# EAGLE schematic DotControl (EAGLE 7.7.0)
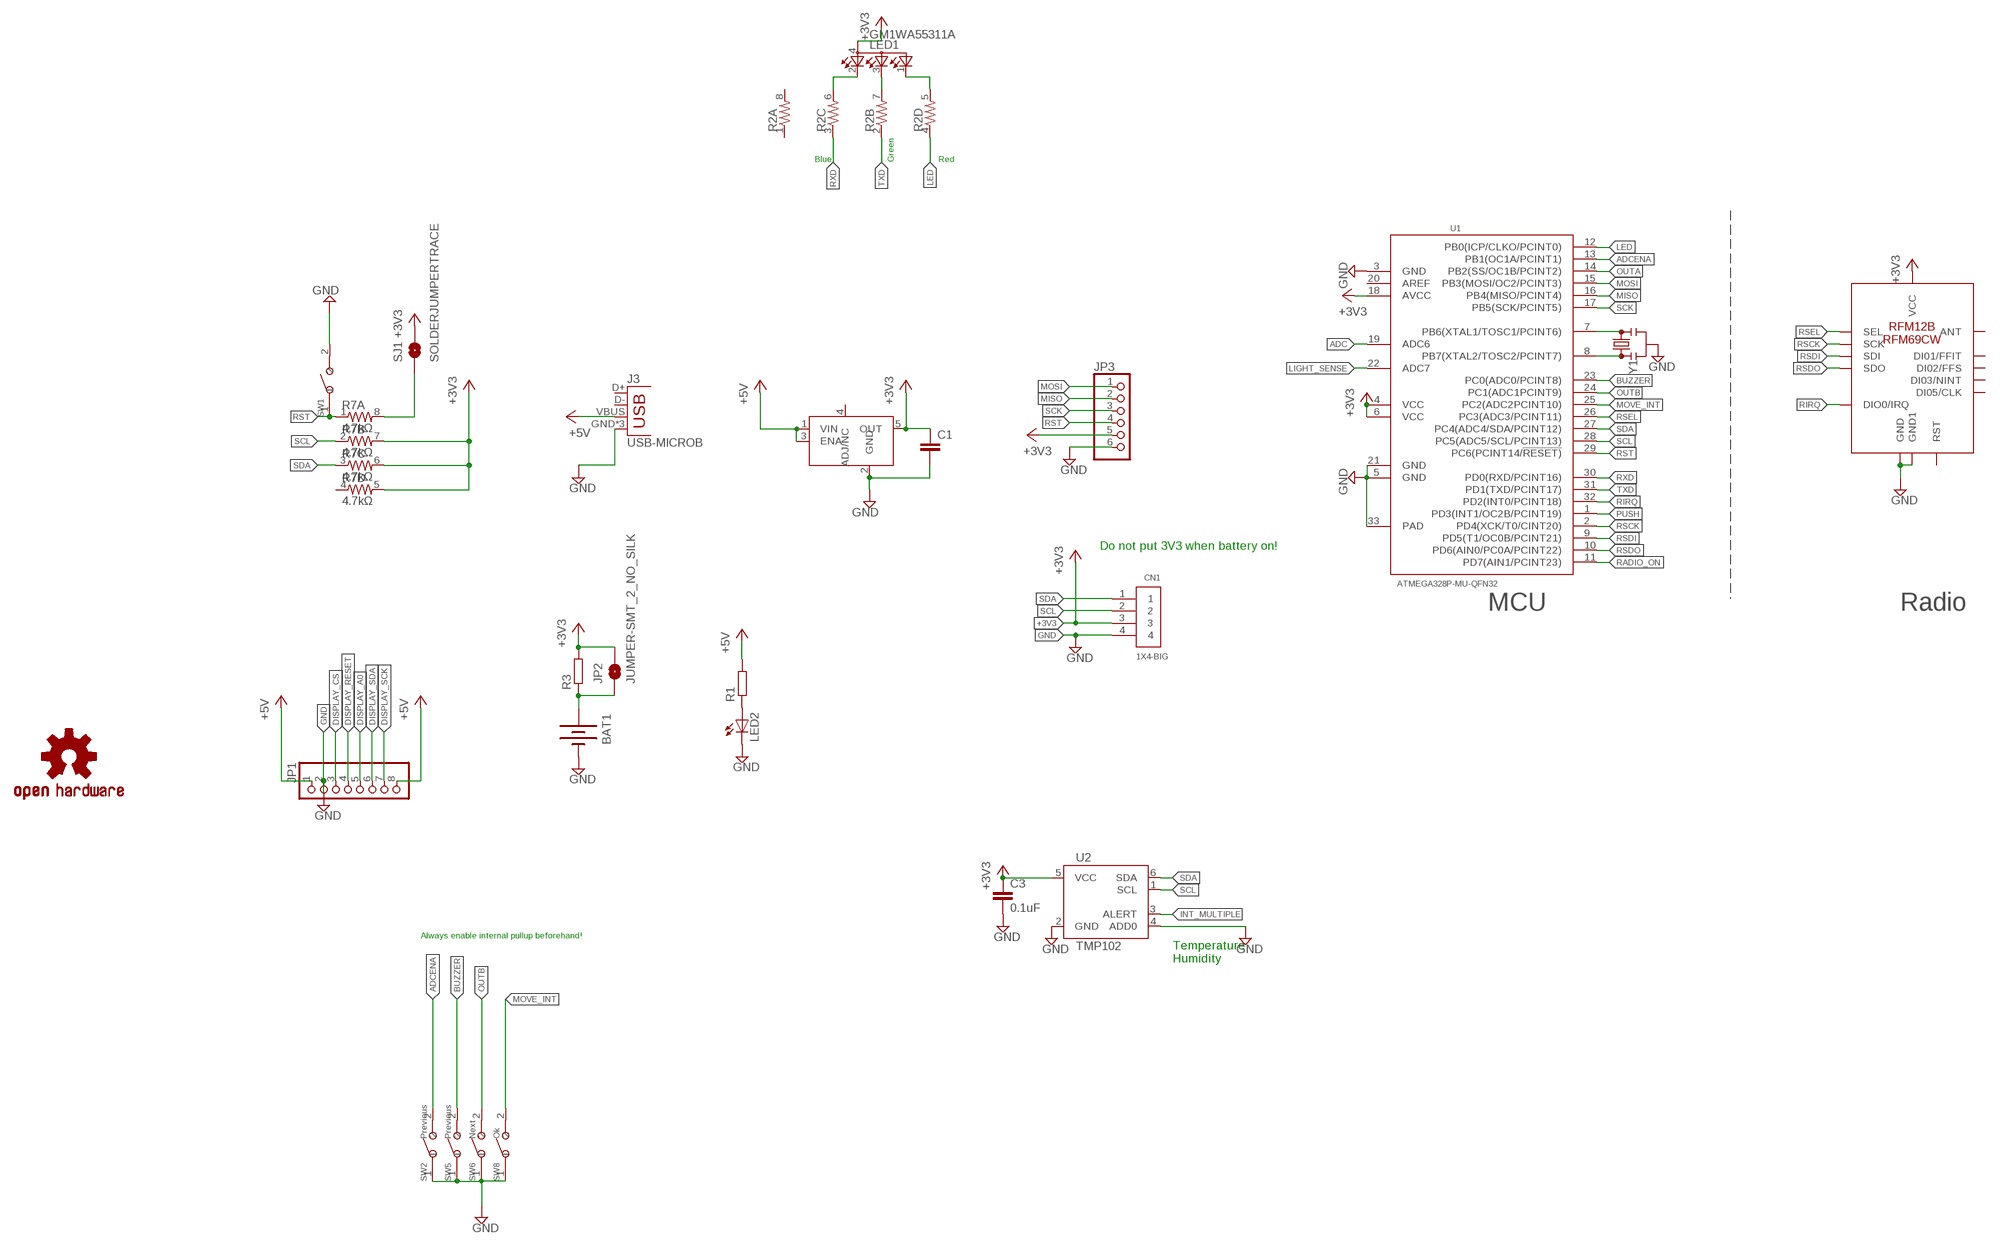
[diagram p0: schematic, sheet 1]

## Parts
BAT1  BATTERY20PTH  [BATTCOM_20MM_PTH]
C1  C-EUC0603  [C0603]
C3  0.1uF  C-EUC0603  [C0603]
CN1  1X4-BIG  [1X04-BIG]
J3  USB-MICROB  [USB-MICROB]
JP1  PINHD-1X8CLEANBIG  [1X08-CLEANBIG]
JP2  JUMPER-SMT_2_NO_SILK  [SMT-JUMPER_2_NO_SILK]
JP3  PINHD-1X6  [1X06]
LED1  GM1WA55311A  [GM1WA55311A]
LED2  LED0603  [LED-0603]
R1  R-EU_R0603  [R0603]
R2  RESISTOR-ARRAY0603-ARV  [0603-ARV]
R3  R-EU_R0603  [R0603]
R7  4.7kΩ  RESISTOR-ARRAY0603-ARV  [0603-ARV]
SJ1  SOLDERJUMPERTRACE  [SJ_2S-TRACE]
SW1  SMD-BUTTON(2P-6.0X3.0X2.5MM)-DHT-1163S  [SW2-4.0-6.0X3.0X2.5MM]
SW2  Previous  SMD-BUTTON(2P-6.0X3.0X2.5MM)-DHT-1163S  [SW2-4.0-6.0X3.0X2.5MM]
SW5  Previous  SMD-BUTTON(2P-6.0X3.0X2.5MM)-DHT-1163S  [SW2-4.0-6.0X3.0X2.5MM]
SW6  Next  SMD-BUTTON(2P-6.0X3.0X2.5MM)-DHT-1163S  [SW2-4.0-6.0X3.0X2.5MM]
SW8  Ok  SMD-BUTTON(2P-6.0X3.0X2.5MM)-DHT-1163S  [SW2-4.0-6.0X3.0X2.5MM]
U1  ATMEGA328P-MU-QFN32  MCU-ATMEGA328P-MU(QFN32)  [QFN32G-0.5-5X5MM]
U2  TMP102  [SOT563]
U$1  RFM12B/69CW  [RFM12B/69CW]
U$2  OSHW-LOGOL  [OSHW-LOGO-L]
U$4  LDCL015  [SOT23-5]
Y1  RESONATORSMD-3.2X1.3  [RESONATOR-SMD-3.2X1.3]

## Nets
+3V3: C1.1 C3.1 CN1.3 JP2.2 JP3.5 LED1.4(A) R3.2 R7.5 R7.6 R7.7 SJ1.2 U1.4(VCC) U1.6(VCC) U1.18(AVCC) U2.5(VCC) U$1.VDD(VCC) U$4.5(OUT)
+5V: J3.VBUS JP1.1 JP1.8 R1.2 U$4.1(VIN) U$4.3(ENA)
ADC: U1.19(ADC6)
ADCENA: SW2.2 U1.13(PB1(OC1A/PCINT1))
BUZZER: SW5.2 U1.23(PC0(ADC0/PCINT8))
DISPLAY_A0: JP1.5
DISPLAY_CS: JP1.3
DISPLAY_RESET: JP1.4
DISPLAY_SCK: JP1.7
DISPLAY_SDA: JP1.6
GND: BAT1.2(-) C1.2 C3.2 CN1.4 J3.GND J3.MT1(GND) J3.MT2(GND) JP1.2 JP3.6 LED2.C SW1.2 SW2.1 SW5.1 SW6.1 SW8.1 U1.3(GND) U1.5(GND) U1.21(GND) U1.33(PAD) U2.2(GND) U2.4(ADD0) U$1.GND U$1.GND1 U$4.2(GND) Y1.2
INT_MULTIPLE: U2.3(ALERT)
LED: R2.4 U1.12(PB0(ICP/CLKO/PCINT0))
LIGHT_SENSE: U1.22(ADC7)
MISO: JP3.2 U1.16(PB4(MISO/PCINT4))
MOSI: JP3.1 U1.15(PB3(MOSI/OC2/PCINT3))
MOVE_INT: SW8.2 U1.25(PC2(ADC2PCINT10))
N$1: LED2.A R1.1
N$2: R7.8 SJ1.1
N$6: U1.7(PB6(XTAL1/TOSC1/PCINT6)) Y1.3
N$8: U1.8(PB7(XTAL2/TOSC2/PCINT7)) Y1.1
N$9: LED1.3(CBLUE) R2.7
N$10: LED1.2(CRED) R2.6
N$15: LED1.1(CGREEN) R2.5
N$16: BAT1.1(+) JP2.1 R3.1
OUTA: U1.14(PB2(SS/OC1B/PCINT2))
OUTB: SW6.2 U1.24(PC1(ADC1PCINT9))
PUSH: U1.1(PD3(INT1/OC2B/PCINT19))
RADIO_ON: U1.11(PD7(AIN1/PCINT23))
RIRQ: U1.32(PD2(INT0/PCINT18)) U$1.IRQ(DIO0/IRQ)
RSCK: U1.2(PD4(XCK/T0/CINT20)) U$1.SCK
RSDI: U1.9(PD5(T1/OC0B/PCINT21)) U$1.SDI
RSDO: U1.10(PD6(AIN0/PC0A/PCINT22)) U$1.SDO
RSEL: U1.26(PC3(ADC3/PCINT11)) U$1.SEL
RST: JP3.4 R7.1 SW1.1 U1.29(PC6(PCINT14/!RESET))
RXD: R2.3 U1.30(PD0(RXD/PCINT16))
SCK: JP3.3 U1.17(PB5(SCK/PCINT5))
SCL: CN1.2 R7.2 U1.28(PC5(ADC5/SCL/PCINT13)) U2.1(SCL)
SDA: CN1.1 R7.3 U1.27(PC4(ADC4/SDA/PCINT12)) U2.6(SDA)
TXD: R2.2 U1.31(PD1(TXD/PCINT17))
Unconnected: J3.D+ J3.D- R2.1 R2.8 R7.4 U1.20(AREF) U$1.ANT U$1.CLK(DI05/CLK) U$1.FFIT(DI01/FFIT) U$1.FFS(DI02/FFS) U$1.NINT(DI03/NINT) U$1.RST U$4.4(ADJ/NC)

## Notes on the sheet
- Blue | Green | Red
- Do not put 3V3 when battery on!
- MCU | Radio
- Always enable internal pullup beforehand!
- Temperature
  Humidity

## Library data of the parts
BAT1 = Battery:BATTERY: Battery Holders Various common sizes : AA, AAA, 20mm coin cell and 12mm coin cell.
C1 = rcl:C-EU: CAPACITOR, European symbol
C3 = resistor:C-EU: CAPACITOR, European symbol
CN1 = adafruit:1X4: 4-pin connector
J3 = SparkFun-Retired:USB: USB Connectors USB-B-PTH is fully proven SKU : PRT-00139/CONN-08278 USB-miniB is fully proven SKU : PRT-00587 USB-A-PCB is untested. USB-A-H is throughly reviewed, but untested. Spark Fun Electronics SKU : PRT-00437 USB-B-SMT is throughly reviewed, but untested. Needs silkscreen touching up. USB-A-S has not been used/tested USB-MB-H has not been used/tested USB-MICROB has been used. CONN-09505; PROD_ID: CONN-09505
JP1 = adafruit:PINHD-1X8: PIN HEADER
JP2 = SparkFun-Jumpers:JUMPER-SMT_2_NO: Normally open jumper This jumper has two pads in close proximity to each other. Apply solder to close the connection. Round pads are easier to solder for beginners, but are a lot larger. SparkFun Product that uses the round pads: SparkFun EL Sequencer <https://www.sparkfun.com/products/12781>
JP3 = adafruit:PINHD-1X6: PIN HEADER
LED1 = led:GM1WA55311A: Chip LED RGB Source: http://document.sharpsma.com/files/GM1WA55311A_SS.pdf
LED2 = SparkFun:LED: LEDs Standard schematic elements and footprints for 5mm, 3mm, 1206, and 0603 sized LEDs. 5mm - Spark Fun Electronics SKU : COM-00529 (and others)
R1 R3 = resistor:R-EU_: RESISTOR, European symbol
R2 R7 = SparkFun:RESISTOR-ARRAY: Array Chip Resistor Source: RS Component / Phycomp
SJ1 = SparkFun:SOLDERJUMPER: Solder Jumper Standard SMD solder jumper. Used to automate production. Two varients : Normally Open and Normally Closed are the same, but have different paste layers. NC will have a large amount of paste and should jumper during reflow.
SW1 SW2 SW5 SW6 SW8 = Seeed-OPL-Switch:SMD-BUTTON(2P-6.0X3.0X2.5MM): 311020029
U1 = Seeed-OPL-ic:MCU-ATMEGA328P-MU(QFN32): 310010005; MPN: ATMEGA328P-MU
U2 = SparkFun:TMP102
U$1 = rfm12b_withoutPlanes:RFM12B/69CW
U$2 = SparkFun:OSHW-LOGO: Open Source Hardware Logo This logo indicates the piece of hardware it is found on incorporates a OSHW license and/or adheres to the definition of open source hardware found here: http://freedomdefined.org/OSHW
U$4 = LDCL015:LDCL015
Y1 = SparkFun-Clocks:RESONATOR: Resonators (Generic) Ceramic resonators are clock-generating components, often used to control timing in microcontrollers. They usually have 3 pins: two pins for oscillation, and one pin for ground. Compared to crystals, resonators have worse tolerance, but are usually much cheaper. Plus, they have built-in load capacitors! These devices are used on boards like the Arduino Pro 8MHz <https://www.sparkfun.com/products/11114> and Arduino Pro 16MHz <https://www.sparkfun.com/products/11113>.